# Altium schematic sheet IMU.SchDoc
size A4
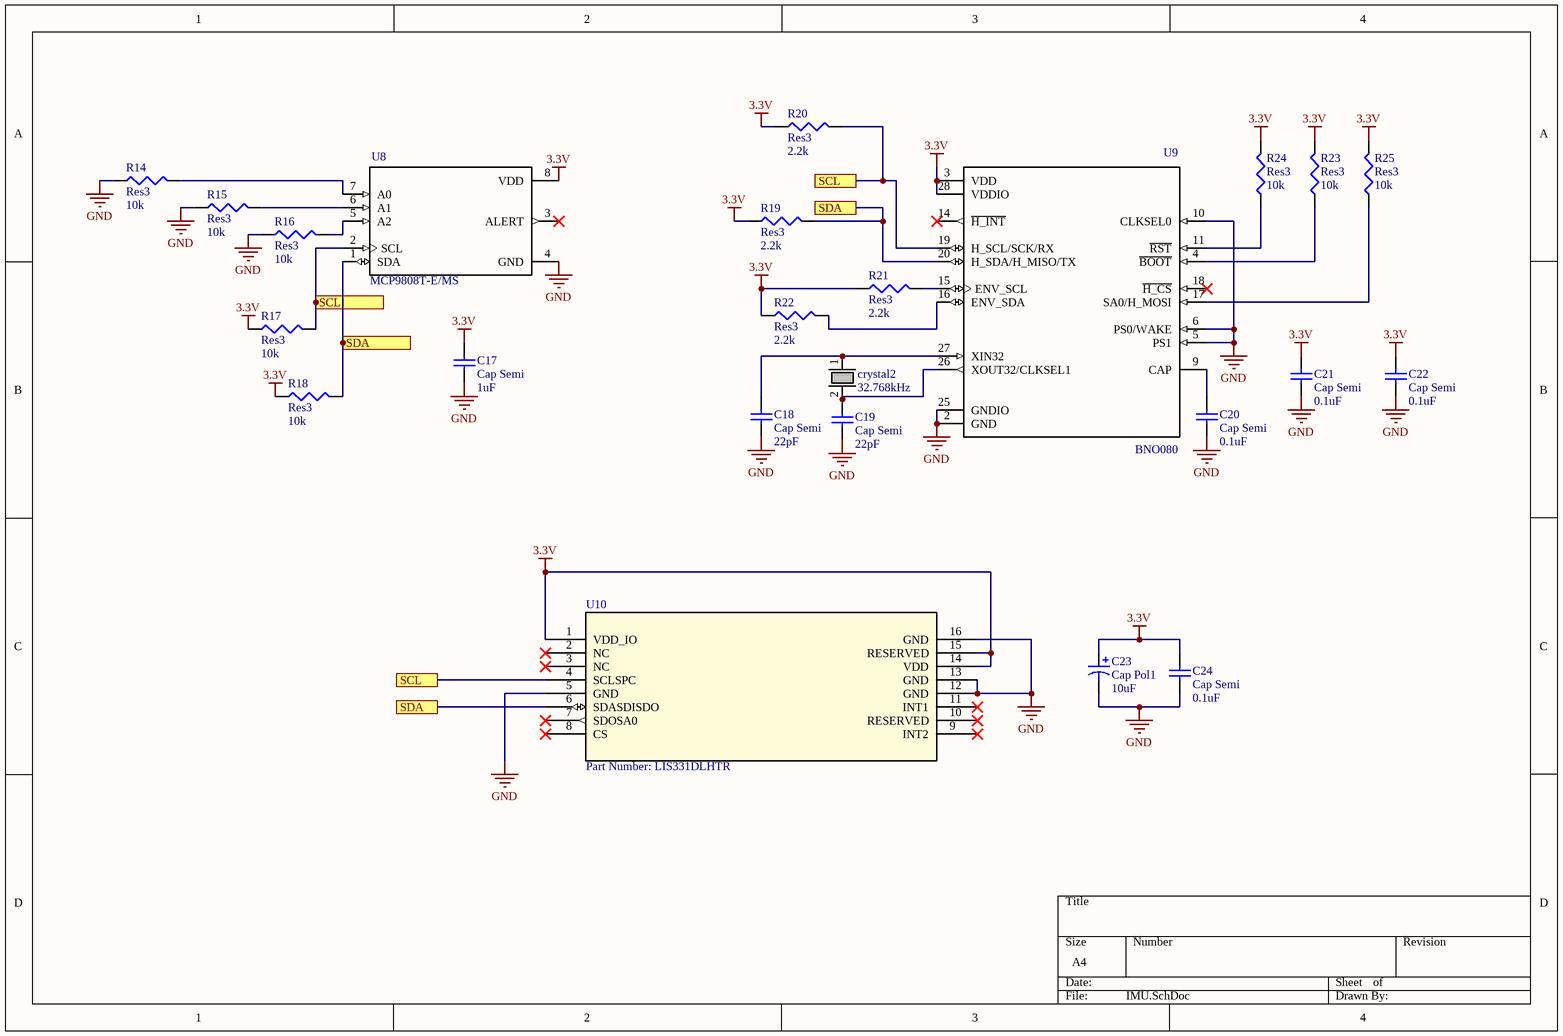
[diagram p0: IMU.SchDoc]

## Parts
C17  Cap Semi  value 1uF  [C1206]
C18  Cap Semi  value 22pF  [C1206]
C19  Cap Semi  value 22pF  [C1206]
C20  Cap Semi  value 0.1uF  [C1206]
C21  Cap Semi  value 0.1uF  [C1206]
C22  Cap Semi  value 0.1uF  [C1206]
C23  Cap Pol1  value 10uF  [C1206]
C24  Cap Semi  value 0.1uF  [C1206]
crystal2  value 32.768kHz  [ECS-.327-CDX-1128]  (hidden comment: SMD_Crystal)
R14  Res3  value 10k  [6-0805_L]
R15  Res3  value 10k  [6-0805_L]
R16  Res3  value 10k  [6-0805_L]
R17  Res3  value 10k  [6-0805_L]
R18  Res3  value 10k  [6-0805_L]
R19  Res3  value 2.2k  [6-0805_L]
R20  Res3  value 2.2k  [6-0805_L]
R21  Res3  value 2.2k  [6-0805_L]
R22  Res3  value 2.2k  [6-0805_L]
R23  Res3  value 10k  [6-0805_L]
R24  Res3  value 10k  [6-0805_L]
R25  Res3  value 10k  [6-0805_L]
U8  MCP9808T-E/MS  [*SOP65P490X110-8N]
U9  BNO080  [*IC_BNO080]
U10  Part Number: LIS331DLHTR  [LGA-16_3x3x1mm-M]

## Ports
SCL, SDA

## Nets
3.3V: C17.2 C21.2 C22.2 C23.1 C24.2 R17.1 R18.1 R19.1 R20.1 R21.1 R22.1 R23.2 R24.2 R25.2 U8.8(VDD) U9.3(VDD) U9.28(VDDIO) U10.1(VDD_IO) U10.14(VDD) U10.15(RESERVED)
GND: C17.1 C18.1 C19.1 C20.1 C21.1 C22.1 C23.2 C24.1 R14.1 R15.1 R16.1 U8.4(GND) U9.2(GND) U9.5(PS1) U9.6(PS0/WAKE) U9.10(CLKSEL0) U9.25(GNDIO) U10.5(GND) U10.12(GND) U10.13(GND) U10.16(GND)
SCL: R17.2 R20.2 U8.2(SCL) U9.19(H_SCL/SCK/RX) U10.4(SCLSPC) ; port SCL
SDA: R18.2 R19.2 U8.1(SDA) U9.20(H_SDA/H_MISO/TX) U10.6(SDASDISDO) ; port SDA
NetC18_2: C18.2 crystal2.1 U9.27(XIN32)
NetC19_2: C19.2 crystal2.2 U9.26(XOUT32/CLKSEL1)
NetC20_2: C20.2 U9.9(CAP)
NetR14_2: R14.2 U8.7(A0)
NetR15_2: R15.2 U8.6(A1)
NetR16_2: R16.2 U8.5(A2)
NetR21_2: R21.2 U9.15(ENV_SCL)
NetR22_2: R22.2 U9.16(ENV_SDA)
NetR23_1: R23.1 U9.4(~{BOOT})
NetR24_1: R24.1 U9.11(~{RST})
NetR25_1: R25.1 U9.17(SA0/H_MOSI)

Not connected (* = marked no-connect by the designer): U8 3(ALERT)*; U9 14(~{H_INT})* 18(~{H_CS})*; U10 2(NC)* 3(NC)* 7(SDOSA0)* 8(CS)* 9(INT2)* 10(RESERVED)* 11(INT1)*

## Library data of the parts
C17 = Cap Semi: Capacitor (Semiconductor SIM Model); SPN: 732-7692-1-ND; Published: 8-Jun-2000; LatestRevisionDate: 29-May-2009; LatestRevisionNote: IPC-7351 Footprint Added.; PackageReference: C1206; Publisher: Altium Limited; PackageDescription: Chip Capacitor
C18 C19 = Cap Semi: Capacitor (Semiconductor SIM Model); SPN: 732-7867-1-ND; Published: 8-Jun-2000; LatestRevisionDate: 29-May-2009; LatestRevisionNote: IPC-7351 Footprint Added.; PackageReference: C1206; Publisher: Altium Limited; PackageDescription: Chip Capacitor
C20-C22 C24 = Cap Semi: Capacitor (Semiconductor SIM Model); SPN: 1276-1017-1-ND; Published: 8-Jun-2000; LatestRevisionDate: 29-May-2009; LatestRevisionNote: IPC-7351 Footprint Added.; PackageReference: C1206; Publisher: Altium Limited; PackageDescription: Chip Capacitor
C23 = Cap Pol1: Polarized Capacitor (Radial); SPN: 478-10743-1-ND; Published: 8-Jun-2000; LatestRevisionDate: 17-Jul-2002; LatestRevisionNote: Re-released for DXP Platform.; PackageReference: RB7.6-15; Publisher: Altium Limited; PackageDescription: Polarized Capacitor (Radial); 2 Leads
crystal2 = ECS-.327-CDX-1128: SPN: XC2190CT-ND
R14-R18 R23-R25 = Res3: Resistor; SPN: RNCP0805FTD10K0CT-ND; Published: 8-Jun-2000; LatestRevisionDate: 29-May-2009; LatestRevisionNote: IPC-7351 Footprint Added.; PackageReference: J1-0603; Publisher: Altium Limited; PackageDescription: Chip Resistor
R19-R22 = Res3: Resistor; SPN: A129545CT-ND; Published: 8-Jun-2000; LatestRevisionDate: 29-May-2009; LatestRevisionNote: IPC-7351 Footprint Added.; PackageReference: J1-0603; Publisher: Altium Limited; PackageDescription: Chip Resistor; Parameter 1: *
U8 = MCP9808T-E/MS: MCP9808 Series 3.6 V Memory Module Digital Temperature Sensor SMT - MSOP-8; MF: Microchip; SPN: MCP9808T-E/MSCT-ND; MP: MCP9808T-E/MS; Availability: Unavailable; SnapEDA_Link: https://www.snapeda.com/parts/MCP9808T-E/MS/Microchip/view-part/?ref=snap; Package: MSOP-8 Microchip; Price: None; Value: *
U9 = BNO080: Imu Accel/Gyro/Mag I2c 32bit; SPN: 1888-1000-1-ND; MF: Hillcrest Laboratories,; Package: TFLGA-28 Hillcrest Laboratories,; Digi-Key_Purchase_URL: https://www.digikey.ca/product-detail/en/hillcrest-laboratories-inc/BNO080/1888-1000-1-ND/7917169?utm_source=snapeda&utm_medium=aggregator&utm_campaign=symbol; SnapEDA_Link: https://www.snapeda.com/parts/BNO080/Hillcrest%20Laboratories%2C%20Inc./view-part/?ref=snap; MP: BNO080; Value: *
U10 = LIS331DLHTR: No Description Available; Vendor: STMicroelectronics; Built_By: EMA_UL_Team; Manufacturer_Part_Number: LIS331DLHTR; Copyright: Copyright (C) 2018 Accelerated Designs. All rights reserved; RefDes: RefDes; Type: DEV; Value: Value